# Altium schematic sheet Clavier.SchDoc
size A4
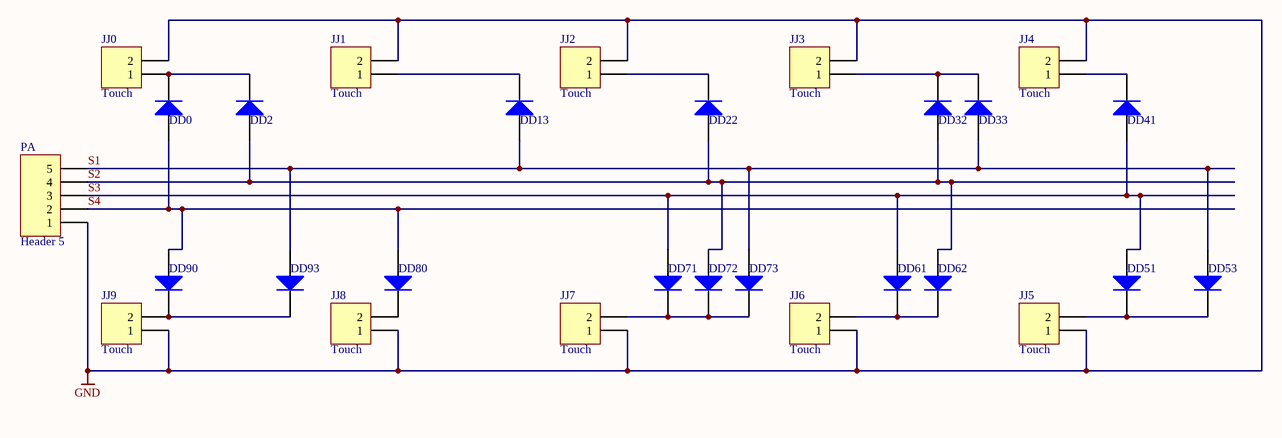
[diagram p0: Clavier.SchDoc]

## Parts
DD0  BAV103  [SOD80C]  (value not drawn)
DD2  BAV103  [SOD80C]  (value not drawn)
DD13  BAV103  [SOD80C]  (value not drawn)
DD22  BAV103  [SOD80C]  (value not drawn)
DD32  BAV103  [SOD80C]  (value not drawn)
DD33  BAV103  [SOD80C]  (value not drawn)
DD41  BAV103  [SOD80C]  (value not drawn)
DD51  BAV103  [SOD80C]  (value not drawn)
DD53  BAV103  [SOD80C]  (value not drawn)
DD61  BAV103  [SOD80C]  (value not drawn)
DD62  BAV103  [SOD80C]  (value not drawn)
DD71  BAV103  [SOD80C]  (value not drawn)
DD72  BAV103  [SOD80C]  (value not drawn)
DD73  BAV103  [SOD80C]  (value not drawn)
DD80  BAV103  [SOD80C]  (value not drawn)
DD90  BAV103  [SOD80C]  (value not drawn)
DD93  BAV103  [SOD80C]  (value not drawn)
JJ0  Touch  [HDR1X2]
JJ1  Touch  [HDR1X2]
JJ2  Touch  [HDR1X2]
JJ3  Touch  [HDR1X2]
JJ4  Touch  [HDR1X2]
JJ5  Touch  [HDR1X2]
JJ6  Touch  [HDR1X2]
JJ7  Touch  [HDR1X2]
JJ8  Touch  [HDR1X2]
JJ9  Touch  [HDR1X2]
PA  Header 5  [HDR1X5]

## Nets
GND: JJ0.2 JJ1.2 JJ2.2 JJ3.2 JJ4.2 JJ5.1 JJ6.1 JJ7.1 JJ8.1 JJ9.1 PA.1
S1: DD13.1(A) DD33.1(A) DD53.1(A) DD73.1(A) DD93.1(A) PA.5
S2: DD2.1(A) DD22.1(A) DD32.1(A) DD62.1(A) DD72.1(A) PA.4
S3: DD41.1(A) DD51.1(A) DD61.1(A) DD71.1(A) PA.3
S4: DD0.1(A) DD80.1(A) DD90.1(A) PA.2
NetDD0_2: DD0.2(K) DD2.2(K) JJ0.1
NetDD13_2: DD13.2(K) JJ1.1
NetDD22_2: DD22.2(K) JJ2.1
NetDD32_2: DD32.2(K) DD33.2(K) JJ3.1
NetDD41_2: DD41.2(K) JJ4.1
NetDD51_2: DD51.2(K) DD53.2(K) JJ5.2
NetDD61_2: DD61.2(K) DD62.2(K) JJ6.2
NetDD71_2: DD71.2(K) DD72.2(K) DD73.2(K) JJ7.2
NetDD80_2: DD80.2(K) JJ8.2
NetDD90_2: DD90.2(K) DD93.2(K) JJ9.2

## Library data of the parts
DD0 DD2 DD13 DD22 DD32 DD33 DD41 DD51 DD53 DD61 DD62 DD71-DD73 DD80 DD90 DD93 = BAV103: General-purpose Diode; Published: 17-Sep-2003; LatestRevisionDate: 19-Mar-2004; LatestRevisionNote: Silkscreen size reduced.; DatasheetVersion: 17-Sep-1996; PackageVersion: Jan-2002; PackageReference: SOD80C; Publisher: Altium Limited; PackageDescription: Metal Electrode Face (MELF) Diode; Body 3.5 x 1.6 mm (LxDia); ComponentLink1Description: Manufacturer Link; ComponentLink1URL: http://www.semiconductors.philips.com/; ComponentLink2Description: Datasheet; ComponentLink2URL: http://www.semiconductors.philips.com/acrobat/datasheets/BAV100_2.pdf
JJ0-JJ9 = Header 2: Header, 2-Pin; LatestRevisionDate: 17-Jul-2002; LatestRevisionNote: Re-released for DXP Platform.; Publisher: Altium Limited
PA = Header 5: Header, 5-Pin; LatestRevisionDate: 17-Jul-2002; LatestRevisionNote: Re-released for DXP Platform.; Publisher: Altium Limited